# Altium project Bicycle_Head_Lamp_MainBrd - Brendan Cook.PrjPcb
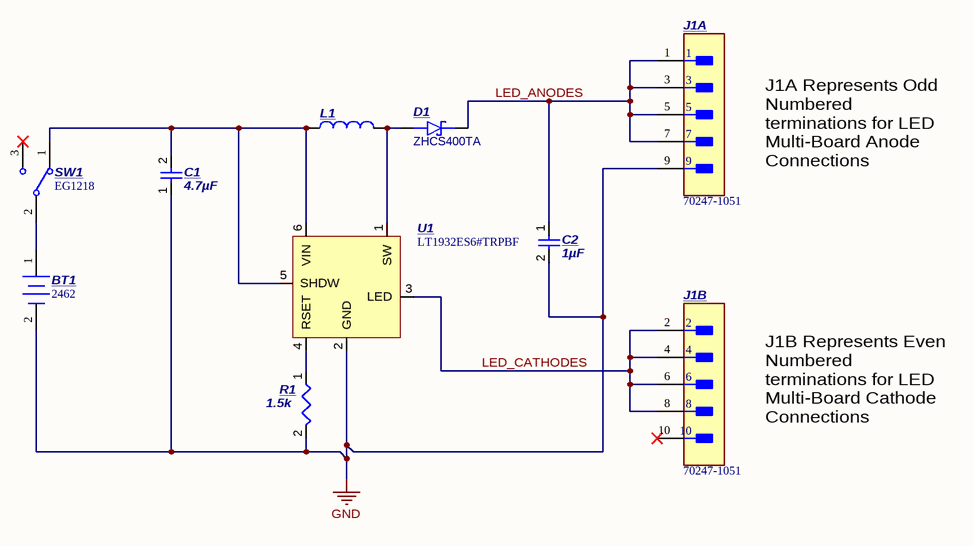
[diagram p0:  SCH_LED_Driver_Battery-PWR.SchDoc]
1 sheet, 9 parts. Net scope: global (net labels, ports and power ports of the same name join across sheets).
Board file:  PCB_LED_Driver_Battery-PWR.PcbDoc

## Sheet  SCH_LED_Driver_Battery-PWR.SchDoc: SCH-Bicycle LED Drv - Batt Pkg
size A4; Date: 05-01-24; Author: AGC; DrawnBy: AGC; Engineer: AGC; Organization: Altium; DocumentNumber: PCB20240501-A; Revision: A; SheetNumber: 1; SheetTotal: 1

### Parts
BT1  2462  [2462-Footprint-1]
C1  value 4.7µF  [0805_L]  (hidden comment: JMK212BJ475KD-T)
C2  value 1µF  [CAPC2013X135X45NL10T25]  (hidden comment: Capacitor 1 uF +/- 10% 50 V 0805)
D1  ZHCS400TA  [FP-SOD323-IPC_C]
J1  70247-1051  [FP-70247-1051-MFG]  (parts A,B of 2)
L1  744032004  [WE-LQ_1210]  (value not drawn)
R1  value 1.5k  [RESC2013X60X35LL10T20]  (hidden comment: RC0805FR-071K5L)
SW1  EG1218  [ESWI-EG1218_V]
U1  LT1932ES6#TRPBF  [DDC0006A_N]

### Nets
GND: BT1.2(-) C1.1 C2.2 J1.9 R1.2 U1.2(GND)
LED_ANODES: C2.1 D1.1(K) J1.1 J1.3 J1.5 J1.7
LED_CATHODES: J1.2 J1.4 J1.6 J1.8 U1.3(LED)
NetBT1_1: BT1.1(+) SW1.2(COM)
NetC1_2: C1.2 L1.1 SW1.1 U1.5(SHDW) U1.6(VIN)
NetD1_2: D1.2(A) L1.2 U1.1(SW)
NetR1_1: R1.1 U1.4(RSET)

Not connected (* = marked no-connect by the designer): J1 10*; SW1 3*

### Notes on the sheet
- J1A Represents Odd Numbered terminations for LED Multi-Board Anode Connections
- J1B Represents Even Numbered terminations for LED Multi-Board Cathode Connections
- Project Number

### Library data of the parts
BT1 = CMP-00029-00002-3: Batteries/Accessories; RoHS Compliant: Yes
C1 = CMP-001-00093-1: Ceramic Capacitor, Multilayer, Ceramic, 6.3V, 10% +Tol, 10% -Tol, X5R, 15% TC, 4.7uF, Surface Mount, 0805; Temperature Characteristics Code: X5R; Min Operating Temperature: -55°C; Length: 2mm; Height: 0.85mm; Capacitor Type: Ceramic; Max Operating Temperature: 85°C; Case/Package: 0805; RoHS Compliant: Yes; Mounting Technology: Surface Mount; Rated DC Voltage (URdc): 6.3V; Pins: 2
C2 = CMP-001-00007-5: Chip Capacitor, 1 uF, +/- 10%, 50 V, 0805 (2012 Metric); Voltage Rating: 50V; Capacitor Type: Ceramic; Tolerance: 10%; Max Operating Temperature: 125°C; Case/Package: 0805; RoHS Compliant: True; Pins: 2; Mounting Technology: SM; Min Operating Temperature: -55°C
D1 = CMP-004-00081-1: Rectifier Diode, Schottky, 1 Phase, 1 Element, 0.4A, 40V V(RRM), Silicon; Forward Voltage: 300mV; Max Power Dissipation: 250mW; Max Output current: 400mA; Non-rep Pk Forward Current-Max: 3A; Reverse Recovery Time-Max: 0.01us; Max Operating Temperature: 150°C; Pins: 2; Technology: SCHOTTKY; Diode Type: RECTIFIER; RoHS Compliant: Yes; Peak Reflow Temperature (Cel): 260°C; Surface Mount: Yes; Rep Pk Reverse Voltage-Max: 40V
J1 = CMP-002-00255-1: Board Connector, 10 Contact(s), 2 Row(s), Male, Right Angle, 0.1 inch Pitch, Solder Terminal, Locking, Black Insulator, Receptacle; Additional Feature: SHROUDED; Contact Pattern: RECTANGULAR; Body Breadth: 0.35inch; Body Length: 0.8inch; Number Of PCB Rows: 2; Body Depth: 0.464inch; Number of Contacts: 10; Contact Finish - Mating: TIN; Max Operating Temperature: 120°C; Mounting Technology: Board; Contact Gender: Male; Terminal Pitch: 2.54mm; Connector Type: BOARD CONNECTOR; Body/Shell Style: RECEPTACLE; RoHS Compliant: Yes; Flammability Rating: UL94 V-0; Min Operating Temperature: -55°C; Mounting Style: RIGHT ANGLE; PartId: 1; System: Connector
L1 = CMP-006-00029-1: General Purpose Inductor, 4.7uH, 20%, 1 Element, Ferrite-Core, SMD, 1210; Shape/Size Description: RECTANGULAR PACKAGE; Quality Factor-Min (at L-nom): 20; Self Resonant Frequency: 31MHz; Package Height: 2mm; Case/Size Code: 1210; Package Width: 2.5mm; Max Current Rating: 490mA; Test Frequency: 1MHz; Package Length: 3.2mm; Shielding: Unshielded; DC Resistance (DCR): 280mR; RoHS Compliant: Yes; Min Operating Temperature: -40°C; Surface Mount: Yes; Inductance-Nom (L): 4.7uH; Reach SVHC Compliant: Yes; Max Operating Temperature: 125°C; Pins: 2; Inductor Type: GENERAL PURPOSE INDUCTOR; Core Material: Ferrite; Tolerance: 20%
R1 = CMP-009-00196-1: Fixed Resistor, Metal Glaze/thick Film, 0.125W, 1500ohm, 150V, 1% +/-Tol, 100ppm/Cel, Surface Mount, 0805; Package Length: 2mm; Package Width: 1.25mm; Power: 125mW; Package Height: 0.5mm; Max Operating Temperature: 155°C; Mounting Technology: Surface Mount; Min Operating Temperature: -55°C; Reach SVHC Compliant: Yes; Case/Package: 0805; RoHS Compliant: Yes; Tolerance: 1%; Construction: Chip; Pins: 2; Resistor Type: FIXED RESISTOR; Working Voltage: 150V
SW1 = CMP-011-00006-1: Slide Switch, SPDT, 500 V, -20 to 70 degC, 3-Pin THD, RoHS, Bulk; Manufacturer: E-Switch; Operating Force: 250gf; Contact Current Rating: 200mA; Voltage Rating (DC): 30V; Packaging: Bulk; Max Operating Temperature: 70°C; Contact Material: Copper; Datasheet URL: https://www.e-switch.com/system/asset/product_line/data_sheet/119/EG.pdf; Current Rating: 200mA; Case/Package: EG1218; Min Operating Temperature: -20°C; Pins: 3; Throw Configuration: SPDT; Package Description: 3-Pin Through Hole Device, Body 11.6 x 4 mm, Pitch 2.5 mm; Voltage Rating (AC): 30V; Package Reference: EG1218; Datasheet Version: Oct-15; Package Quantity: 1000; Mounting Technology: TH; RoHS Compliant: True; Manufacturer URL: http://www.e-switch.ch/en/; Contact Plating: Silver; Contact Finish: Silver
U1 = CMP-00024-00006-1: Switching Regulator, Current-mode, 0.78A, 1600kHz Switching Freq-Max, PDSO6; Nominal Supply Current: 30mA; Voltage Rating: 4.5V; Nominal Supply Voltage: 1.2V; Min Operating Temperature: 0°C; Mounting Technology: SMD; Pins: 6; Max Operating Temperature: 70°C; RoHS Compliant: Yes; Case/Package: LSSOP